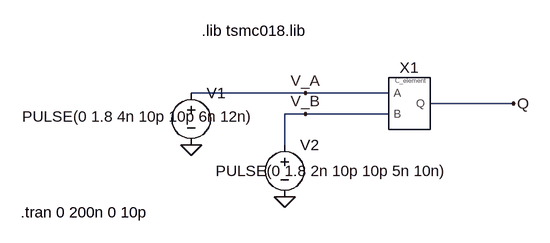
[diagram p0: schematic c_element_test.asc]
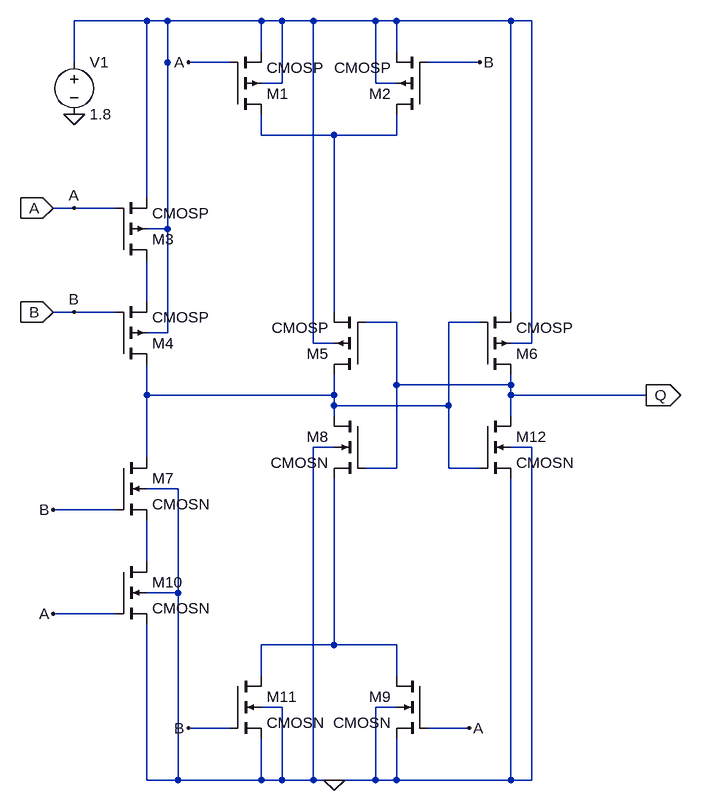
[diagram p1: sub-circuit muller_c_sutherland.asc]
c_element_test.asc, the LTspice schematic file:
Version 4
SHEET 1 880 680
WIRE 144 112 -32 112
WIRE 272 112 144 112
WIRE 464 128 336 128
WIRE 144 144 112 144
WIRE 272 144 144 144
WIRE 112 192 112 144
FLAG -32 192 0
FLAG 112 272 0
FLAG 464 128 Q
FLAG 144 112 V_A
FLAG 144 144 V_B
SYMBOL voltage -32 96 R0
WINDOW 3 -260 52 Left 2
WINDOW 123 0 0 Left 0
WINDOW 39 0 0 Left 0
SYMATTR InstName V1
SYMATTR Value PULSE(0 1.8 4n 10p 10p 6n 12n)
SYMBOL voltage 112 176 R0
WINDOW 3 -106 56 Left 2
WINDOW 123 0 0 Left 0
WINDOW 39 0 0 Left 0
SYMATTR InstName V2
SYMATTR Value PULSE(0 1.8 2n 10p 10p 5n 10n)
SYMBOL Muller_c_sutherland 304 128 R0
SYMATTR InstName X1
TEXT -16 16 Left 2 !.lib tsmc018.lib
TEXT -294 296 Left 2 !.tran 0 200n 0 10p

muller_c_sutherland.asc, the sub-circuit schematic file:
Version 4
SHEET 1 880 1236
WIRE -32 -64 -144 -64
WIRE 0 -64 -32 -64
WIRE 144 -64 0 -64
WIRE 176 -64 144 -64
WIRE 224 -64 176 -64
WIRE 320 -64 224 -64
WIRE 352 -64 320 -64
WIRE 528 -64 352 -64
WIRE 560 -64 528 -64
WIRE 144 -16 144 -64
WIRE 352 -16 352 -64
WIRE -144 0 -144 -64
WIRE 96 0 32 0
WIRE 480 0 400 0
WIRE 176 32 176 -64
WIRE 176 32 144 32
WIRE 320 32 320 -64
WIRE 352 32 320 32
WIRE 144 112 144 80
WIRE 256 112 144 112
WIRE 352 112 352 80
WIRE 352 112 256 112
WIRE -32 208 -32 -64
WIRE -144 224 -176 224
WIRE -80 224 -144 224
WIRE 0 256 0 -64
WIRE 0 256 -32 256
WIRE -32 368 -32 304
WIRE -144 384 -176 384
WIRE -80 384 -144 384
WIRE 256 384 256 112
WIRE 528 384 528 -64
WIRE 352 400 304 400
WIRE 480 400 432 400
WIRE 0 416 0 256
WIRE 0 416 -32 416
WIRE 224 432 224 -64
WIRE 256 432 224 432
WIRE 560 432 560 -64
WIRE 560 432 528 432
WIRE 352 496 352 400
WIRE 528 496 528 480
WIRE 528 496 352 496
WIRE -32 512 -32 464
WIRE 256 512 256 480
WIRE 256 512 -32 512
WIRE 528 512 528 496
WIRE 736 512 528 512
WIRE 256 528 256 512
WIRE 432 528 432 400
WIRE 432 528 256 528
WIRE 256 544 256 528
WIRE 528 544 528 512
WIRE 256 592 224 592
WIRE 560 592 528 592
WIRE -32 608 -32 512
WIRE 352 624 352 496
WIRE 352 624 304 624
WIRE 432 624 432 528
WIRE 480 624 432 624
WIRE 16 656 -32 656
WIRE -80 688 -176 688
WIRE -32 768 -32 704
WIRE 16 816 16 656
WIRE 16 816 -32 816
WIRE -80 848 -176 848
WIRE 256 896 256 640
WIRE 256 896 144 896
WIRE 352 896 256 896
WIRE 144 944 144 896
WIRE 352 944 352 896
WIRE 176 992 144 992
WIRE 352 992 320 992
WIRE 96 1024 32 1024
WIRE 464 1024 400 1024
WIRE -32 1104 -32 864
WIRE 16 1104 16 816
WIRE 16 1104 -32 1104
WIRE 144 1104 144 1040
WIRE 144 1104 16 1104
WIRE 176 1104 176 992
WIRE 176 1104 144 1104
WIRE 224 1104 224 592
WIRE 224 1104 176 1104
WIRE 256 1104 224 1104
WIRE 320 1104 320 992
WIRE 320 1104 256 1104
WIRE 352 1104 352 1040
WIRE 352 1104 320 1104
WIRE 528 1104 528 640
WIRE 528 1104 352 1104
WIRE 560 1104 560 592
WIRE 560 1104 528 1104
WIRE 0 0 0 0
FLAG 736 512 Q
IOPIN 736 512 Out
FLAG -176 224 A
IOPIN -176 224 In
FLAG -176 384 B
IOPIN -176 384 In
FLAG 32 0 A
FLAG 480 0 B
FLAG -176 688 B
FLAG -176 848 A
FLAG 32 1024 B
FLAG 464 1024 A
FLAG 256 1104 0
FLAG -144 80 0
FLAG -144 224 A
FLAG -144 384 B
SYMBOL pmos4 96 80 M180
SYMATTR InstName M1
SYMATTR Value CMOSP
SYMATTR Value2 l=180n w=440n
SYMBOL pmos4 400 80 R180
SYMATTR InstName M2
SYMATTR Value CMOSP
SYMATTR Value2 l=180n w=440n
SYMBOL pmos4 -80 304 M180
SYMATTR InstName M3
SYMATTR Value CMOSP
SYMATTR Value2 l=180n w=440n
SYMBOL pmos4 -80 464 M180
SYMATTR InstName M4
SYMATTR Value CMOSP
SYMATTR Value2 l=180n w=440n
SYMBOL pmos4 304 480 R180
SYMATTR InstName M5
SYMATTR Value CMOSP
SYMATTR Value2 l=180n w=440n
SYMBOL pmos4 480 480 M180
SYMATTR InstName M6
SYMATTR Value CMOSP
SYMATTR Value2 l=180n w=440n
SYMBOL nmos4 -80 608 R0
SYMATTR InstName M7
SYMATTR Value CMOSN
SYMATTR Value2 l=180n w=220n
SYMBOL nmos4 304 544 M0
SYMATTR InstName M8
SYMATTR Value CMOSN
SYMATTR Value2 l=180n w=220n
SYMBOL nmos4 400 944 M0
SYMATTR InstName M9
SYMATTR Value CMOSN
SYMATTR Value2 l=180n w=220n
SYMBOL nmos4 -80 768 R0
SYMATTR InstName M10
SYMATTR Value CMOSN
SYMATTR Value2 l=180n w=220n
SYMBOL nmos4 96 944 R0
SYMATTR InstName M11
SYMATTR Value CMOSN
SYMATTR Value2 l=180n w=220n
SYMBOL nmos4 480 544 R0
SYMATTR InstName M12
SYMATTR Value CMOSN
SYMATTR Value2 l=180n w=220n
SYMBOL voltage -144 -16 R0
WINDOW 123 0 0 Left 0
WINDOW 39 0 0 Left 0
SYMATTR InstName V1
SYMATTR Value 1.8

The netlist it stands for:
* c_element_test.asc
V1 V_A 0 PULSE(0 1.8 4n 10p 10p 6n 12n)
V2 V_B 0 PULSE(0 1.8 2n 10p 10p 5n 10n)
XX1 V_A V_B Q muller_c_sutherland

* block symbol definitions
.subckt muller_c_sutherland A B Q
M1 N002 A N001 N001 CMOSP l=180n w=440n
M2 N002 B N001 N001 CMOSP l=180n w=440n
M3 N003 A N001 N001 CMOSP l=180n w=440n
M4 N004 B N003 N001 CMOSP l=180n w=440n
M5 N004 Q N002 N001 CMOSP l=180n w=440n
M6 Q N004 N001 N001 CMOSP l=180n w=440n
M7 N004 B N005 0 CMOSN l=180n w=220n
M8 N004 Q N006 0 CMOSN l=180n w=220n
M9 N006 A 0 0 CMOSN l=180n w=220n
M10 N005 A 0 0 CMOSN l=180n w=220n
M11 N006 B 0 0 CMOSN l=180n w=220n
M12 Q N004 0 0 CMOSN l=180n w=220n
V1 N001 0 1.8
.ends muller_c_sutherland

.model NMOS NMOS
.model PMOS PMOS
.lib standard.mos
.lib tsmc018.lib
.tran 0 200n 0 10p
.backanno
.end